# EAGLE design hidiot_1.0_final (EAGLE 7.6.0)
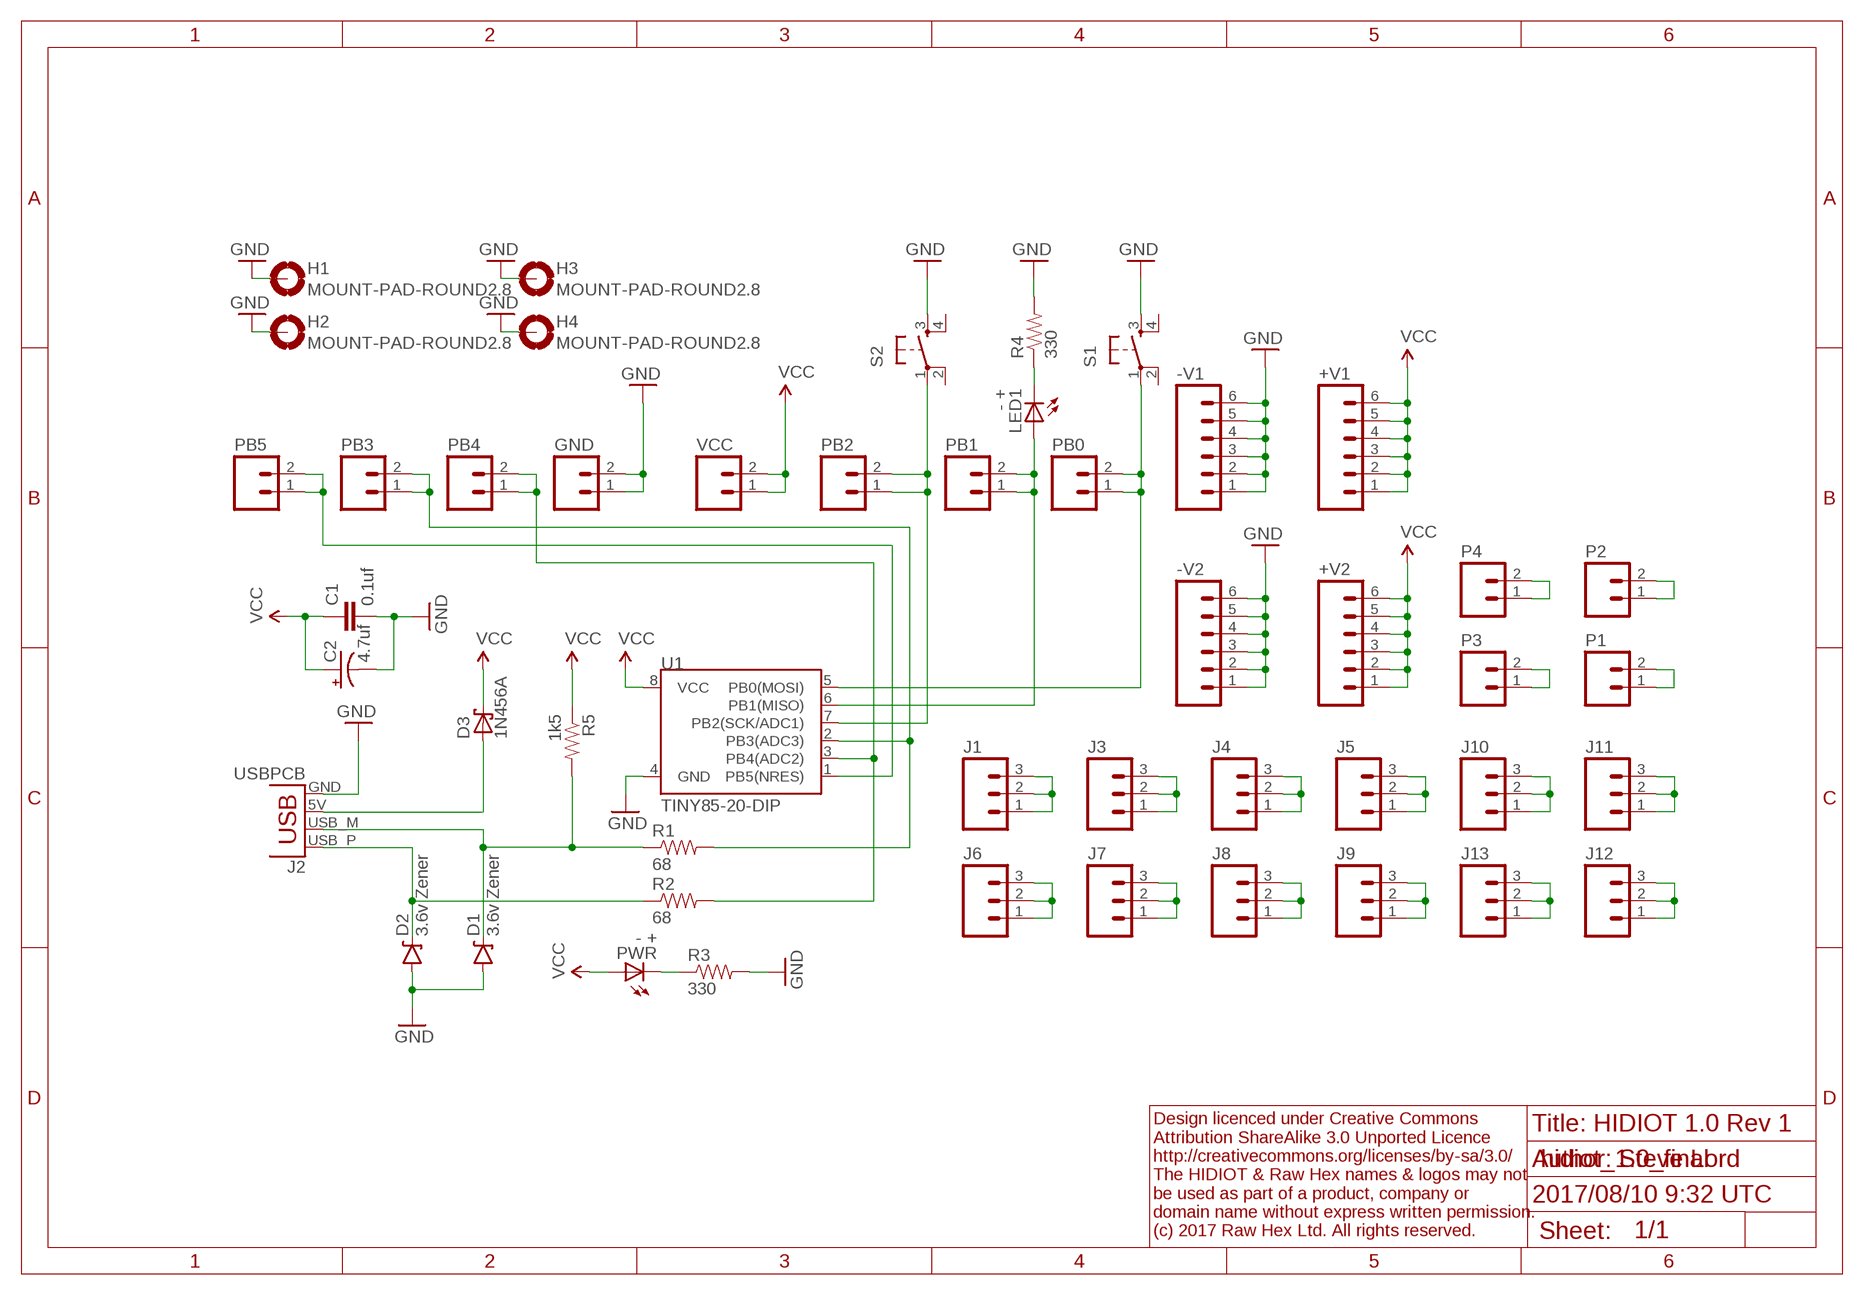
[diagram p0: schematic, sheet 1]

## Parts
+V1  M06SILK_FEMALE_PTH  [1X06]
+V2  M06SILK_FEMALE_PTH  [1X06]
-V1  M06SILK_FEMALE_PTH  [1X06]
-V2  M06SILK_FEMALE_PTH  [1X06]
C1  0.1uf  0.1UF-50V-20%(PTH)KIT-EZ  [CAP-PTH-SMALL-KIT]
C2  4.7uf  100UF-25V-20%(PTH)  [CPOL-RADIAL-100UF-25V]
D1  3.6v Zener  DIODE-ZENERPTH  [DIODE-ZENER]
D2  3.6v Zener  DIODE-ZENERPTH  [DIODE-ZENER]
D3  1N456A  SCHOTTKY-DIODEDO35-7  [DIODE_DO35-7]
GND  M02PTH  [1X02]
H1  MOUNT-PAD-ROUND2.8  [2,8-PAD]
H2  MOUNT-PAD-ROUND2.8  [2,8-PAD]
H3  MOUNT-PAD-ROUND2.8  [2,8-PAD]
H4  MOUNT-PAD-ROUND2.8  [2,8-PAD]
J1  M03PTH  [1X03]
J2  USBPCB  [USB-A-PCB]
J3  M03PTH  [1X03]
J4  M03PTH  [1X03]
J5  M03PTH  [1X03]
J6  M03PTH  [1X03]
J7  M03PTH  [1X03]
J8  M03PTH  [1X03]
J9  M03PTH  [1X03]
J10  M03PTH  [1X03]
J11  M03PTH  [1X03]
J12  M03PTH  [1X03]
J13  M03PTH  [1X03]
LED1  - +  LED3MM  [LED3MM]
P1  M02PTH  [1X02]
P2  M02PTH  [1X02]
P3  M02PTH  [1X02]
P4  M02PTH  [1X02]
PB0  M02PTH  [1X02]
PB1  M02PTH  [1X02]
PB2  M02PTH  [1X02]
PB3  M02PTH  [1X02]
PB4  M02PTH  [1X02]
PB5  M02PTH  [1X02]
PWR  - +  LED3MM  [LED3MM]
R1  68  RESISTORPTH-1/4W  [AXIAL-0.4]
R2  68  RESISTORPTH-1/4W  [AXIAL-0.4]
R3  330  RESISTORPTH-1/4W  [AXIAL-0.4]
R4  330  RESISTORPTH-1/4W  [AXIAL-0.4]
R5  1k5  RESISTORPTH-1/4W  [AXIAL-0.4]
S1  TAC_SWITCHPTH  [TACTILE-PTH]
S2  TAC_SWITCHPTH  [TACTILE-PTH]
U1  TINY85-20-DIP  ATTINY45TINY85-20-DIP  [DIP08]
VCC  M02PTH  [1X02]

## Nets
GND: -V1.1 -V1.2 -V1.3 -V1.4 -V1.5 -V1.6 -V2.1 -V2.2 -V2.3 -V2.4 -V2.5 -V2.6 C1.2 C2.2(-) D1.P$2(A) D2.P$2(A) GND.1 GND.2 H1.B2,8(MOUNT) H2.B2,8(MOUNT) H3.B2,8(MOUNT) H4.B2,8(MOUNT) J2.GND R3.P$2 R4.P$2 S1.3 S2.3 U1.4(GND)
N$1: PB5.1 PB5.2 U1.1(PB5(NRES))
N$2: LED1.K(C) R4.P$1
N$3: PB2.1 PB2.2 S2.1 U1.7(PB2(SCK/ADC1))
N$4: PB3.1 PB3.2 R1.P$2 U1.2(PB3(ADC3))
N$5: PB4.1 PB4.2 R2.P$2 U1.3(PB4(ADC2))
N$6: PB0.1 PB0.2 S1.1 U1.5(PB0(MOSI))
N$7: D2.P$1(C) J2.USB_P(D+) R2.P$1
N$8: D1.P$1(C) J2.USB_M(D-) R1.P$1 R5.P$2
N$9: D3.A(C) J2.5V(VBUS)
N$10: LED1.A PB1.1 PB1.2 U1.6(PB1(MISO))
N$11: PWR.K(C) R3.P$1
N$12: J1.1 J1.2 J1.3
N$13: J3.1 J3.2 J3.3
N$14: J4.1 J4.2 J4.3
N$15: J5.1 J5.2 J5.3
N$16: J8.1 J8.2 J8.3
N$17: J7.1 J7.2 J7.3
N$18: J6.1 J6.2 J6.3
N$19: J9.1 J9.2 J9.3
N$20: J10.1 J10.2 J10.3
N$21: J11.1 J11.2 J11.3
N$22: J12.1 J12.2 J12.3
N$24: J13.1 J13.2 J13.3
N$26: P1.1 P1.2
N$27: P2.1 P2.2
N$30: P3.1 P3.2
N$31: P4.1 P4.2
VCC: +V1.1 +V1.2 +V1.3 +V1.4 +V1.5 +V1.6 +V2.1 +V2.2 +V2.3 +V2.4 +V2.5 +V2.6 C1.1 C2.1(+) D3.C(A) PWR.A R5.P$1 U1.8(VCC) VCC.1 VCC.2
Unconnected: S1.2 S1.4 S2.2 S2.4

## Notes on the sheet
- Design licenced under Creative Commons
  Attribution ShareAlike 3.0 Unported Licence
  http://creativecommons.org/licenses/by-sa/3.0/
  The HIDIOT & Raw Hex names & logos may not
  be used as part of a product, company or
  domain name without express written permission.
  (c) 2017 Raw Hex Ltd. All rights reserved.
- Title: HIDIOT 1.0 Rev 1
- Author: Steve Lord
- 2017/08/10 9:32 UTC

## Library data of the parts
+V1 +V2 -V1 -V2 = SparkFun-Connectors:M06: Header 6 Standard 6-pin 0.1" header. Use with straight break away headers (SKU : PRT-00116), right angle break away headers (PRT-00553), swiss pins (PRT-00743), machine pins (PRT-00117), and female headers (PRT-00115). Molex polarized connector foot print use with SKU : PRT-08094 with associated crimp pins and housings. NOTES ON THE VARIANTS LOCK and LOCK_LONGPADS... This footprint was designed to help hold the alignment of a through-hole component (i.e. 6-pin header) while soldering it into place. You may notice that each hole has been shifted either up or down by 0.005 of an inch from it's more standard position (which is a perfectly straight line). This slight alteration caused the pins (the squares in the middle) to touch the edges of the holes. Because they are alternating, it causes a "brace" to hold the component in place. 0.005 has proven to be the perfect amount of "off-center" position when using our standard breakaway headers. Although looks a little odd when you look at the bare footprint, once you have a header in there, the alteration is very hard to notice. Also,if you push a header all the way into place, it is covered up entirely on the bottom side. This idea of altering the position of holes to aid alignment will be further integrated into the Sparkfun Library for other footprints. It can help hold any component with 3 or more connection pins.; PROD_ID: CONN-08437
C1 = SparkFun-Capacitors:0.1UF-50V-20%(PTH): CAP-08370; MF: VISHAY; MPN: K104K15X7RF5TH5; OC_FARNELL: 1692300; PROD_ID: CAP-08370
C2 = SparkFun-Capacitors:100UF-25V-20%(PTH): CAP-08439; MF: MULTICOMP; MPN: MCGPR50V475M5X11; OC_FARNELL: 9451374; PROD_ID: CAP-08439
D1 D2 = SparkFun-DiscreteSemi:DIODE-ZENER: Zener Diode Production Part - 8199 3.4V Zener Voltage; MF: MULTICOMP; MPN: 1N4729A; OC_FARNELL: 1861444
D3 = eagle-ltspice:SCHOTTKY-DIODE: Schottky Diode; MF: FAIRCHILD SEMICONDUCTOR; MPN: 1N456A; OC_FARNELL: 1467557; SPICEMODEL: NONE; SPICEPREFIX: D; SPICETYPE: diode
GND P1-P4 PB0 PB1-PB5 VCC = SparkFun-Connectors:M02: Standard 2-pin 0.1" header. Use with - straight break away headers ( PRT-00116) - right angle break away headers (PRT-00553) - swiss pins (PRT-00743) - machine pins (PRT-00117) - female headers (PRT-00115) Molex polarized connector foot print use with: PRT-08233 with associated crimp pins and housings. 2.54_SCREWTERM for use with PRT-10571. 3.5mm Screw Terminal footprints for PRT-08084 5mm Screw Terminal footprints for use with PRT-08432
H1-H4 = holes:MOUNT-PAD-ROUND: MOUNTING PAD, round
J1 J3-J13 = SparkFun-Connectors:M03: Header 3 Standard 3-pin 0.1" header. Use with straight break away headers (SKU : PRT-00116), right angle break away headers (PRT-00553), swiss pins (PRT-00743), machine pins (PRT-00117), and female headers (PRT-00115). Molex polarized connector foot print use with SKU : PRT-08232 with associated crimp pins and housings.
J2 = SparkFun-Connectors:USB: USB Connectors USB-B-PTH is fully proven SKU : PRT-00139/CONN-08278 USB-miniB is fully proven SKU : PRT-00587 USB-A-PCB is untested. USB-A-H is throughly reviewed, but untested. Spark Fun Electronics SKU : PRT-00437 USB-B-SMT is throughly reviewed, but untested. Needs silkscreen touching up. USB-A-S has not been used/tested USB-MB-H has not been used/tested USB-MICROB has been used. CONN-09505; OC_FARNELL: unknown
LED1 PWR = led:LED: LED OSRAM: - CHIPLED LG R971, LG N971, LY N971, LG Q971, LY Q971, LO R971, LY R971 LH N974, LH R974 LS Q976, LO Q976, LY Q976 LO Q996 - Hyper CHIPLED LW Q18S LB Q993, LB Q99A, LB R99A - SideLED LS A670, LO A670, LY A670, LG A670, LP A670 LB A673, LV A673, LT A673, LW A673 LH A674 LY A675 LS A676, LA A676, LO A676, LY A676, LW A676 LS A679, LY A679, LG A679 - Hyper Micro SIDELED® LS Y876, LA Y876, LO Y876, LY Y876 LT Y87S - SmartLED LW L88C, LW L88S LB L89C, LB L89S, LG L890 LS L89K, LO L89K, LY L89K LS L896, LA L896, LO L896, LY L896 - TOPLED LS T670, LO T670, LY T670, LG T670, LP T670 LSG T670, LSP T670, LSY T670, LOP T670, LYG T670 LG T671, LOG T671, LSG T671 LB T673, LV T673, LT T673, LW T673 LH T674 LS T676, LA T676, LO T676, LY T676, LB T676, LH T676, LSB T676, LW T676 LB T67C, LV T67C, LT T67C, LS T67K, LO T67K, LY T67K, LW E67C LS E67B, LA E67B, LO E67B, LY E67B, LB E67C, LV E67C, LT E67C LW T67C LS T679, LY T679, LG T679 LS T770, LO T770, LY T770, LG T770, LP T770 LB T773, LV T773, LT T773, LW T773 LH T774 LS E675, LA E675, LY E675, LS T675 LS T776, LA T776, LO T776, LY T776, LB T776 LHGB T686 LT T68C, LB T68C - Hyper Mini TOPLED® LB M676 - Mini TOPLED Santana® LG M470 LS M47K, LO M47K, LY M47K Source: http://www.osram.convergy.de LUXEON: - LUMILED® LXK2-PW12-R00, LXK2-PW12-S00, LXK2-PW14-U00, LXK2-PW14-V00 LXK2-PM12-R00, LXK2-PM12-S00, LXK2-PM14-U00 LXK2-PE12-Q00, LXK2-PE12-R00, LXK2-PE12-S00, LXK2-PE14-T00, LXK2-PE14-U00 LXK2-PB12-K00, LXK2-PB12-L00, LXK2-PB12-M00, LXK2-PB14-N00, LXK2-PB14-P00, LXK2-PB14-Q00 LXK2-PR12-L00, LXK2-PR12-M00, LXK2-PR14-Q00, LXK2-PR14-R00 LXK2-PD12-Q00, LXK2-PD12-R00, LXK2-PD12-S00 LXK2-PH12-R00, LXK2-PH12-S00 LXK2-PL12-P00, LXK2-PL12-Q00, LXK2-PL12-R00 Source: www.luxeon.com KINGBRIGHT: KA-3528ASYC Source: www.kingbright.com; MF: AVAGO TECHNOLOGIES; MPN: HLMP-K150; OC_FARNELL: 1003206
R1-R4 = SparkFun-Passives:RESISTOR: Resistor Basic schematic elements and footprints for 0603, 1206, and PTH resistors.; MF: MULTICOMP; MPN: MCF 0.25W 68R; OC_FARNELL: 9339647
R5 = SparkFun-Passives:RESISTOR: Resistor Basic schematic elements and footprints for 0603, 1206, and PTH resistors.; MF: MULTICOMP; MPN: MCF 1W 1K5; OC_FARNELL: 9337741
S1 S2 = SparkFun-Retired:TAC_SWITCH: Momentary Switch Button commonly used for reset or general input. Spark Fun Electronics SKU : COM-00097 SMT- SWCH-08247
U1 = SparkFun-DigitalIC:ATTINY45: Atmel 8-pin 2/4/8kB flash uC; MF: ATMEL; MPN: ATTINY85-20PU; OC_FARNELL: 1455162; PROD_ID: IC-09445

## Net classes
0 default: clearance 0.205 mm

## Board
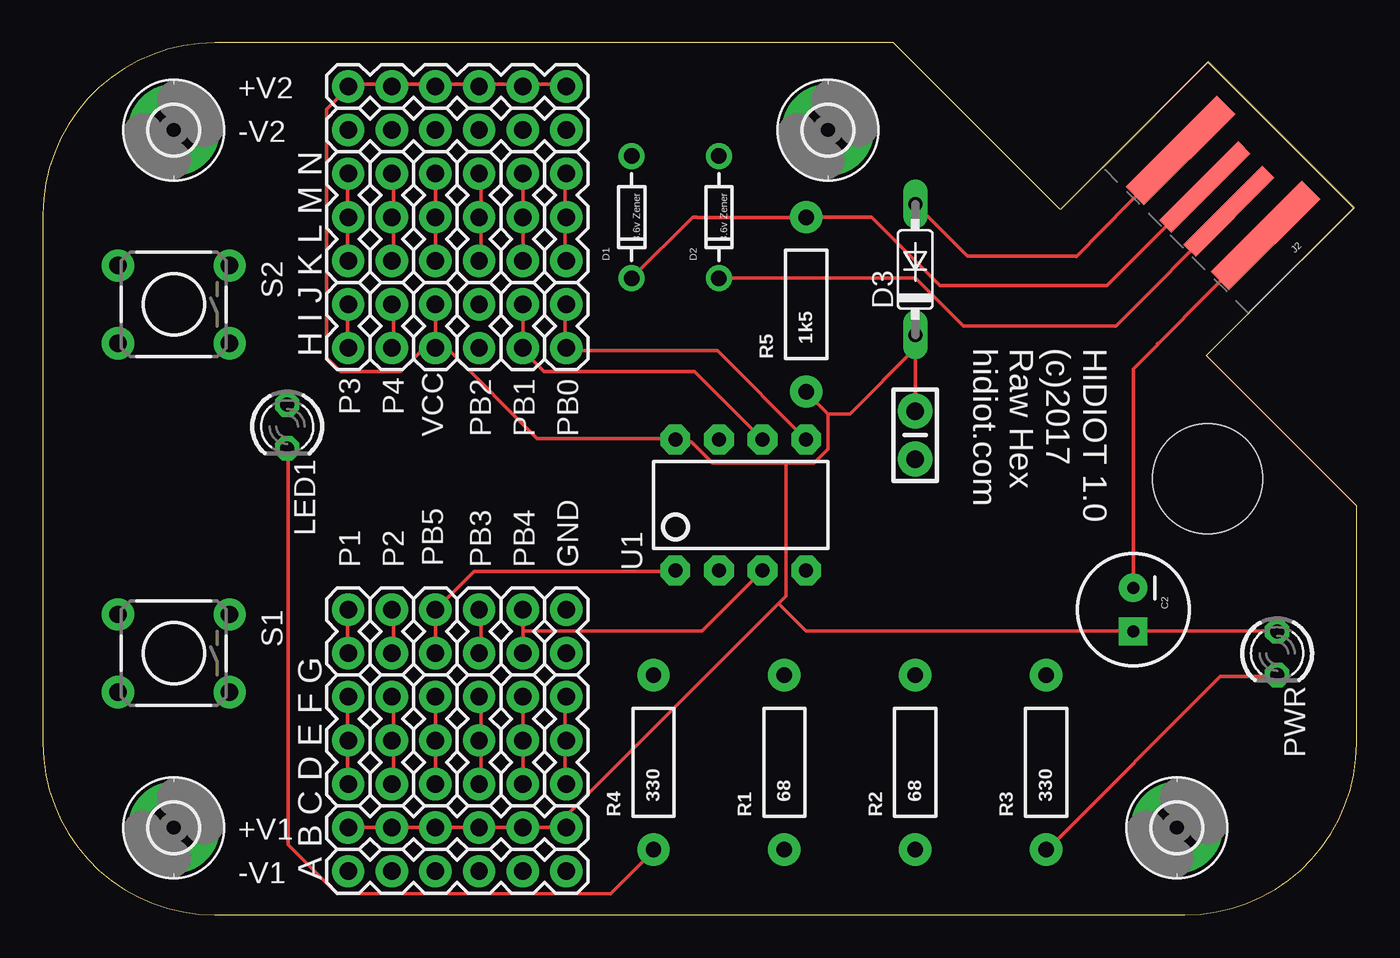
[diagram p1: board, top side]
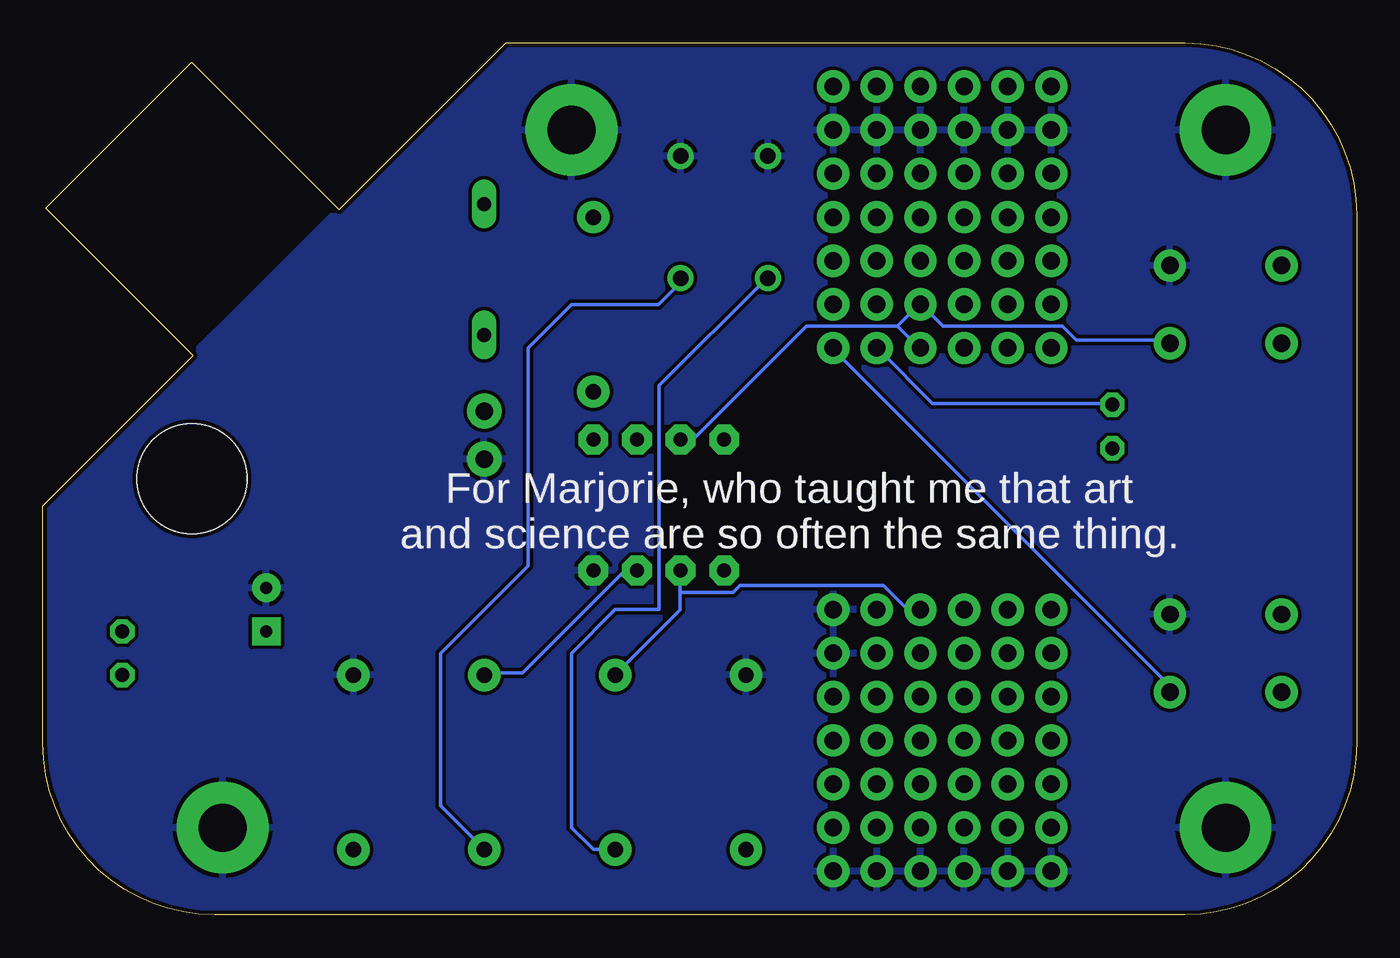
[diagram p2: board, bottom side, seen from below]

Size 76.5 x 50.79 mm. Coordinates in mm from the lower left corner, seen from the top.
Outline: 0,40.79 0,10 arc90 10,0 66.5,0 arc90 76.5,10 76.5,23.82 67.75,32.59 76.33,41.17 67.84,49.66 59.26,41.08 49.54,50.79 10,50.79 arc90 0,40.79
Copper layers (1*16): Top 0.035mm / dielectric 1.5mm / Bottom 0.035mm
Design rules "SparkFun": minimum track width 8mil, minimum drill 20mil, track to track 8mil, track to pad 8mil, pad to pad 8mil, via to via 8mil, smd to smd 8mil, copper to edge 10mil, drill to drill 8mil, minimum pad ring 12mil, minimum via ring 10mil, stop-mask expansion 4mil, vias tented up to drill 25mil, thermal gap 10mil
Holes 6.4 mm at 67.82,25.4

### Footprints (pad centres in the part's own frame; a part is rotated, then mirrored left to right if it is on the bottom)
1X06 = drill 1.016 pad 1.88: 1 0,0; 2 2.54,0; 3 5.08,0; 4 7.62,0; 5 10.16,0; 6 12.7,0
CAP-PTH-SMALL-KIT = drill 1.016 pad 2.032: 1 -1.397,0; 2 1.397,0
CPOL-RADIAL-100UF-25V = drill 0.7 pad 1.651 square: 1 1.27,0 | drill 0.7 pad 1.651: 2 -1.27,0
DIODE-ZENER = drill 0.9: P$1 -3.556,0; P$2 3.556,0
DIODE_DO35-7 = drill 0.813 long: A 3.81,0; C -3.81,0
1X02 = drill 1.016 pad 1.88: 1 0,0; 2 2.54,0
2,8-PAD = drill 2.8 pad 5.334: B2,8 0,0
1X03 = drill 1.016 pad 1.88: 1 0,0; 2 2.54,0; 3 5.08,0
USB-A-PCB = smd 7.5 x 1.5: 5V -0.2,-3.5; GND -0.2,3.5 | smd 6.5 x 1: USB_M 0.3,-1; USB_P 0.3,1
LED3MM = drill 0.813 octagon: A -1.27,0; K 1.27,0
AXIAL-0.4 = drill 0.9 pad 1.88: P$1 -5.08,0; P$2 5.08,0
TACTILE-PTH = drill 1.016 pad 1.88: 1 -3.251,2.261; 2 3.251,2.261; 3 -3.251,-2.261; 4 3.251,-2.261
DIP08 = drill 0.813 pad 1.727 octagon: 1 -3.81,-3.81; 2 -1.27,-3.81; 3 1.27,-3.81; 4 3.81,-3.81; 5 3.81,3.81; 6 1.27,3.81; 7 -1.27,3.81; 8 -3.81,3.81

### Placement (x,y rotation side)
+V1  17.78,5.08 0 top
+V2  17.78,48.26 0 top
-V1  17.78,2.54 0 top
-V2  17.78,45.72 0 top
C1  50.8,27.94 270 top
C2  63.5,17.78 270 top
D1  34.29,40.64 90 top
D2  39.37,40.64 90 top
D3  50.8,37.59 90 top
GND  30.48,15.24 90 top
H1  7.62,5.08 0 top
H2  7.62,45.72 0 top
H3  45.72,45.72 0 top
H4  66.04,5.08 0 top
J1  22.86,7.62 90 top
J2  68.58,41.91 225 top
J3  25.4,7.62 90 top
J4  27.94,7.62 90 top
J5  30.48,7.62 90 top
J6  22.86,38.1 90 top
J7  25.4,38.1 90 top
J8  27.94,38.1 90 top
J9  30.48,38.1 90 top
J10  20.32,7.62 90 top
J11  17.78,7.62 90 top
J12  20.32,38.1 90 top
J13  17.78,38.1 90 top
LED1  14.22,28.45 270 top
P1  17.78,15.24 90 top
P2  20.32,15.24 90 top
P3  17.78,33.02 90 top
P4  20.32,33.02 90 top
PB0  30.48,33.02 90 top
PB1  27.94,33.02 90 top
PB2  25.4,33.02 90 top
PB3  25.4,15.24 90 top
PB4  27.94,15.24 90 top
PB5  22.86,15.24 90 top
PWR  71.88,15.24 270 top
R1  43.18,8.89 90 top
R2  50.8,8.89 90 top
R3  58.42,8.89 90 top
R4  35.56,8.89 90 top
R5  44.45,35.56 90 top
S1  7.62,15.24 180 top
S2  7.62,35.56 180 top
U1  40.64,23.88 0 top
VCC  22.86,33.02 90 top

### Tracks (layer width: path | path; a pad name or v marks a point on that pad's centre or on a via)
GND
  Top 0.203: 64.94,33.24 64.93,33.23 63.5,31.8 C2.2 63.68,19.18 | 64.94,33.24 71.03,39.39 J2.GND | 64.9,33.27 64.94,33.24
  pour Bottom: 49.53,50.8 76.45,24 76.2,8.89 arc-90 67.31,0 8.89,0 arc-90 0,8.89 0,41.91 arc-90 8.89,50.8
N$1
  Top 0.203: U1.1 36.74,20 25.1,20 23.06,17.96 PB5.2 22.86,17.76 22.86,15.31 PB5.1
N$2
  Top 0.203: LED1.K 14.29,27.14 14.29,4.08 17.14,1.23 33.06,1.23 35.51,3.67 R4.P$1
N$3
  Bottom 0.203: 26.74,34.29 32.04,34.29 38.58,27.76 39.19,27.76 U1.7 | 26.74,34.29 25.51,35.51 PB2.2 25.31,35.51 24.08,34.29 17.14,34.29 16.33,33.47 11.02,33.47 S2.1 | 26.74,34.29 25.51,33.06 PB2.1
N$4
  Top 0.203: PB3.1 25.51,15.31 25.51,17.76 PB3.2
  Bottom 0.203: 39.39,18.78 39.39,17.76 43.06,14.08 R1.P$2 | 39.39,18.78 39.39,20 U1.2 | 39.39,18.78 36.33,18.78 35.92,19.18 27.55,19.18 26.33,17.96 25.51,17.96 PB3.2
N$5
  Top 0.203: 27.96,16.53 27.96,17.76 PB4.2 | 27.96,16.53 27.96,15.31 PB4.1 | 27.96,16.53 38.37,16.53 41.84,20 U1.3
  Bottom 0.203: U1.3 42.05,20 42.66,20 48.58,14.08 50.62,14.08 R2.P$2
N$6
  Top 0.203: PB0.2 30.41,35.51 30.41,33.06 PB0.1 30.61,32.86 39.28,32.86 U1.5
  Bottom 0.203: S1.1 11.02,13.06 11.02,13.47 30.41,32.86 PB0.1
N$7
  Top 0.203: 39.39,37.15 D2.P$1 50.8,37.08 53.59,34.29 62.45,34.29 62.48,34.29 68.99,40.82 J2.USB_P
  Bottom 0.203: R2.P$1 53.34,6.35 53.34,15.24 48.26,20.32 48.26,33.02 45.72,35.56 40.64,35.56 39.37,36.83 D2.P$1
N$8
  Top 0.203: 34.49,37.15 D1.P$1 37.85,40.64 38.1,40.64 38.12,40.62 44.29,40.62 R5.P$2 | 62.04,36.74 61.96,36.66 52.24,36.66 48.26,40.64 R5.P$2 | 62.04,36.74 67.56,42.25 J2.USB_M | 44.49,40.62 R5.P$2 | 62.05,36.74 62.04,36.74
  Bottom 0.203: D1.P$1 34.49,36.94 40.62,30.82 40.62,17.8 40.64,17.78 43.18,17.78 45.72,15.24 45.72,5.08 44.45,3.81 R1.P$1
N$9
  Top 0.203: J2.5V 60.21,38.37 | 60.21,38.37 60.2,38.35 | 50.82,41.23 D3.A 53.83,38.37 60.21,38.37 | 60.21,38.37
N$10
  Top 0.203: 14.29,29.8 LED1.A | 27.76,32.86 PB1.1 | PB1.1 27.96,32.86 29.19,31.64 37.96,31.64 U1.6 | PB1.2 27.96,35.51 27.96,33.06 PB1.1
  Bottom 0.203: LED1.A 14.29,29.8 24.7,29.8 27.76,32.86 PB1.1
N$11
  Top 0.203: PWR.K 71.84,13.88 68.58,13.88 58.58,3.88 R3.P$1
N$12
  Top 0.203: J1.1 22.86,7.76 22.86,10 J1.2 22.86,10.21 22.86,12.65 J1.3
N$13
  Top 0.203: J3.1 25.51,7.76 25.51,10 J3.2 25.51,10.21 25.51,12.65 J3.3
N$14
  Top 0.203: J4.1 27.96,7.76 27.96,10 J4.2 27.96,10.21 27.96,12.65 J4.3
N$15
  Top 0.203: J5.1 30.41,7.76 30.41,10 J5.2 30.41,10.21 30.41,12.65 J5.3
N$16
  Top 0.203: J8.1 27.96,38.17 27.96,40.62 J8.2 27.96,40.82 27.96,43.06 J8.3
N$17
  Top 0.203: J7.1 25.51,38.17 25.51,40.62 J7.2 25.51,40.82 25.51,43.06 J7.3
N$18
  Top 0.203: J6.1 22.86,38.17 22.86,40.62 J6.2 22.86,40.82 22.86,43.06 J6.3
N$19
  Top 0.203: J9.1 30.41,38.17 30.41,40.62 J9.2 30.41,40.82 30.41,43.06 J9.3
N$20
  Top 0.203: J10.1 20.41,7.76 20.41,10 J10.2 20.41,10.21 20.41,12.65 J10.3
N$21
  Top 0.203: J11.1 17.76,7.76 17.76,10 J11.2 17.76,10.21 17.76,12.65 J11.3
N$22
  Top 0.203: J12.1 20.41,38.17 20.41,40.62 J12.2 20.41,40.82 20.41,43.06 J12.3
N$24
  Top 0.203: J13.1 17.76,38.17 17.76,40.62 J13.2 17.76,40.82 17.76,43.06 J13.3
N$26
  Top 0.203: P1.1 17.76,15.31 17.76,17.76 P1.2
N$27
  Top 0.203: P2.1 20.41,15.31 20.41,17.76 P2.2
N$30
  Top 0.203: P3.1 17.76,33.06 17.76,35.51 P3.2
N$31
  Top 0.203: P4.1 20.41,33.06 20.41,35.51 P4.2
VCC
  Top 0.203: VCC.1 22.86,33.06 22.86,35.51 VCC.2 | +V2.6 30.41,48.37 27.96,48.37 +V2.5 27.76,48.37 25.51,48.37 +V2.4 25.31,48.37 23.06,48.37 +V2.3 22.86,48.37 20.41,48.37 +V2.2 20.21,48.37 17.96,48.37 +V2.1 17.76,48.17 16.53,46.94 16.53,32.45 17.35,31.64 20.82,31.64 22.04,32.86 22.86,32.86 VCC.1 | +V1.1 17.96,5.1 20.21,5.1 +V1.2 20.41,5.1 22.86,5.1 +V1.3 23.06,5.1 25.31,5.1 +V1.4 25.51,5.1 27.76,5.1 +V1.5 27.96,5.1 30.41,5.1 +V1.6 30.61,5.1 30.61,5.92 42.83,18.13 | PWR.A 71.84,16.53 63.68,16.53 C2.1 63.48,16.53 44.43,16.53 42.83,18.13 | 50.82,33.02 50.82,29.39 C1.1 50.82,29.19 | 50.82,33.02 50.82,33.68 D3.C | 43.27,26.33 44.9,26.33 45.72,27.14 45.72,29.19 | 43.27,26.33 38.98,26.33 37.76,27.55 36.94,27.55 U1.8 36.74,27.76 28.78,27.76 23.68,32.86 23.06,32.86 VCC.1 | 45.72,29.19 44.49,30.41 R5.P$1 | 42.83,18.13 43.27,18.57 43.27,26.33 | 45.72,29.19 46.99,29.19 50.82,33.02
  Bottom 0.203: 44.49,30.41 R5.P$1 | 30.61,48.17 +V2.6

### Text on the board
tSilk: H I J K L M N | HIDIOT 1.0 / (c)2017 / Raw Hex / hidiot.com | A B C D E F G
_bsilk: For Marjorie, who taught me that art / and science are so often the same thing.